# Altium schematic sheet LPCB235 - MLP IF.SchDoc
size A3; Address1: Factory 10; Address2: 9-13 Dingley Avenue, Dandeong, VICTORIA 3175, AUSTRALIA; DocumentNumber: 17; Revision: 1; SheetNumber: 17; SheetTotal: 37; Lockie__PCB_SUB_ASSEMBLY: MLP Interface; Lockie__PCB_ASSEMBLY: FCU PCB; Lockie__LDL: LPCB235; Lockie__PCB_DESCRIPTION: Flight Control Unit
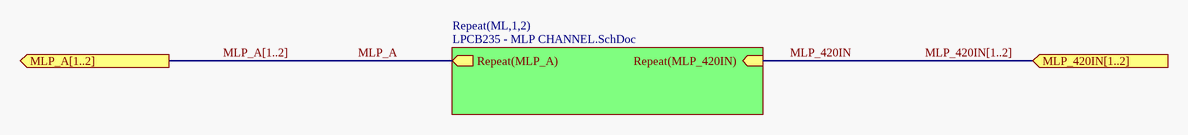
[diagram p0: LPCB235 - MLP IF.SchDoc]

## Sub-sheets
Repeat(ML,1,2) = LPCB235 - MLP CHANNEL.SchDoc: Repeat(MLP_A) (out), Repeat(MLP_420IN) (in)

## Ports
MLP_420IN[1..2] (in), MLP_A[1..2] (out)

## Nets
MLP_420IN: sheet Repeat(ML,1,2)/Repeat(MLP_420IN)
MLP_A: sheet Repeat(ML,1,2)/Repeat(MLP_A)

## Buses and harness runs
bus MLP_420IN[1..2] = port MLP_420IN[1..2]
bus MLP_A[1..2] = port MLP_A[1..2]

## Notes on the sheet
- PCB COMPONENT DESCRIPTION
- LDL NUMBER
- Assembly Details
- Size
- Drawing File Name
- Revision
- http://rloop.org
- Scale
- A3
- Sheet Details
- N.T.S
- Sheet:
- Of: